# Altium schematic sheet STM32H7_PART_2.SchDoc
size A; Organization: Altium Limited; Address1: L3, 12a Rodborough Rd; Address2: Frenchs Forest; Address3: NSW; Address4: Australia 2086
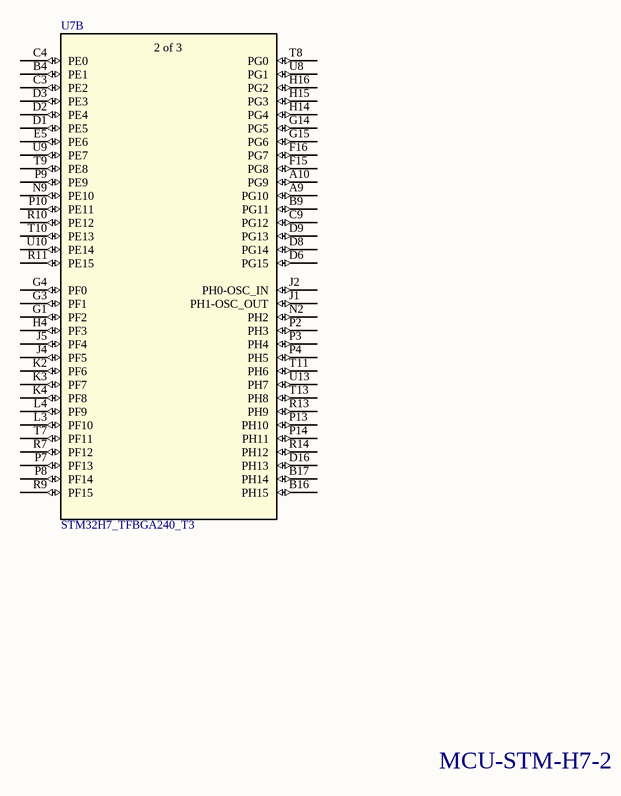
[diagram p0: STM32H7_PART_2.SchDoc]

## Parts
U7  STM32H7_TFBGA240_T3  [TFBGA240+25]  (part B of 4)

## Nets

Not connected (* = marked no-connect by the designer): U7 A9(PG10) A10(PG9) B4(PE1) B9(PG11) B16(PH15) B17(PH14) C3(PE2) C4(PE0) C9(PG12) D1(PE5) D2(PE4) D3(PE3) D6(PG15) D8(PG14) D9(PG13) D16(PH13) E5(PE6) F15(PG8) F16(PG7) G1(PF2) G3(PF1) G4(PF0) G14(PG5) G15(PG6) H4(PF3) H14(PG4) H15(PG3) H16(PG2) J1(PH1-OSC_OUT) J2(PH0-OSC_IN) J4(PF5) J5(PF4) K2(PF6) K3(PF7) K4(PF8) L3(PF10) L4(PF9) N2(PH2) N9(PE10) P2(PH3) P3(PH4) P4(PH5) P7(PF13) P8(PF14) P9(PE9) P10(PE11) P13(PH10) P14(PH11) R7(PF12) R9(PF15) R10(PE12) R11(PE15) R13(PH9) R14(PH12) T7(PF11) T8(PG0) T9(PE8) T10(PE13) T11(PH6) T13(PH8) U8(PG1) U9(PE7) U10(PE14) U13(PH7)

## Notes on the sheet
- MCU-STM-H7-2
- Title
- Size:
- Date:
- A
- Number:
- Time:
- Revision:
- Sheet
- of
- File:
- (in symbol STM32H7_TFBGA240, part B) 2 of 3

## Library data of the parts
U7 = STM32H7_TFBGA240: No Description Available; Vendor: STMicroelectronics; Copyright: Copyright (C) 2018 Accelerated Designs. All rights reserved; Manufacturer_Part_Number: STM32H7_TFBGA240_T3; RefDes: RefDes; Type: DEV